# Altium schematic sheet Power.SchDoc
size A4; SheetNumber: 2; SheetTotal: 3
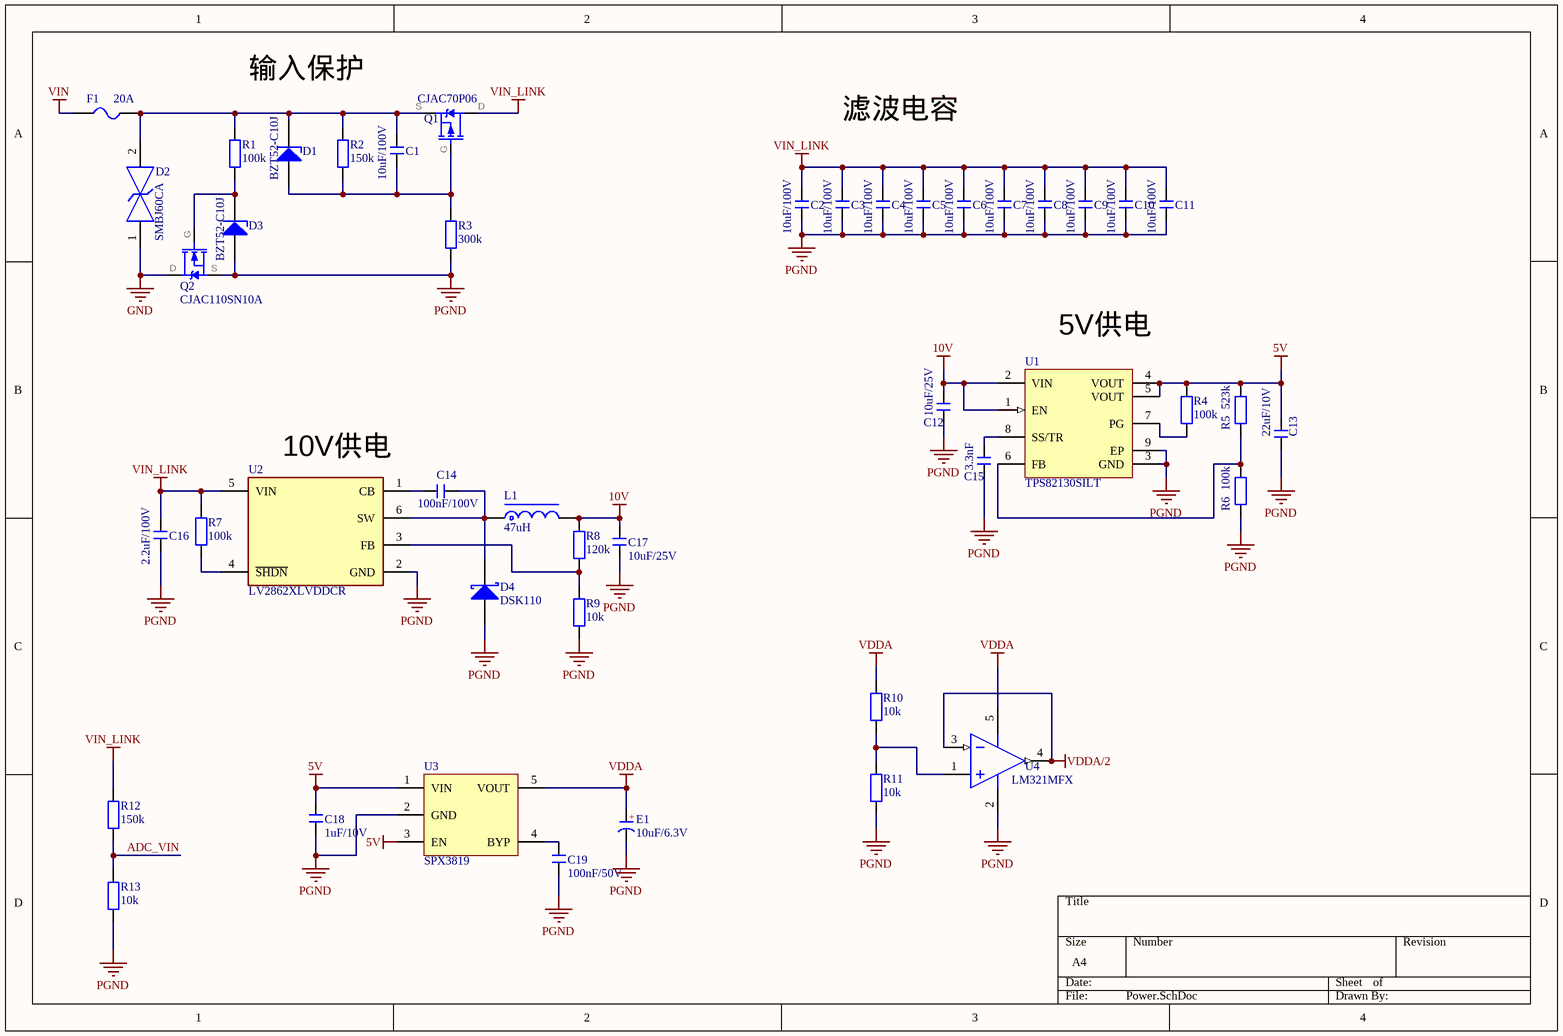
[diagram p0: Power.SchDoc]

## Parts
C1  10uF/100V  [Capacitor_1206_SMD]
C2  10uF/100V  [Capacitor_1206_SMD]
C3  10uF/100V  [Capacitor_1206_SMD]
C4  10uF/100V  [Capacitor_1206_SMD]
C5  10uF/100V  [Capacitor_1206_SMD]
C6  10uF/100V  [Capacitor_1206_SMD]
C7  10uF/100V  [Capacitor_1206_SMD]
C8  10uF/100V  [Capacitor_1206_SMD]
C9  10uF/100V  [Capacitor_1206_SMD]
C10  10uF/100V  [Capacitor_1206_SMD]
C11  10uF/100V  [Capacitor_1206_SMD]
C12  10uF/25V  [Capacitor_0603_SMD]
C13  22uF/10V  [Capacitor_0603_SMD]
C14  100nF/100V  [Capacitor_0603_SMD]
C15  3.3nF  [Capacitor_0402_SMD]
C16  2.2uF/100V  [Capacitor_1206_SMD]
C17  10uF/25V  [Capacitor_0603_SMD]
C18  1uF/10V  [Capacitor_0402_SMD]
C19  100nF/50V  [Capacitor_0402_SMD]
D1  BZT52-C10J  [SOD-123FL]
D2  SMBJ60CA  [FP-SMBJ-CA-MFG]
D3  BZT52-C10J  [SOD-123FL]
D4  DSK110  [SOD-123FL]
E1  10uF/6.3V  [Tantalum_Capacitor_0805_SMD]
F1  20A  [FU 1808]
L1  47uH  [Molded_Inductor_0530]
Q1  CJAC70P06  [PDFNWB5×6-8L]
Q2  CJAC110SN10A  [PDFNWB5×6-8L]
R1  100k  [Resistor_0402_SMD]
R2  150k  [Resistor_0402_SMD]
R3  300k  [Resistor_0402_SMD]
R4  100k  [Resistor_0402_SMD]
R5  523k  [Resistor_0402_SMD]
R6  100k  [Resistor_0402_SMD]
R7  100k  [Resistor_0402_SMD]
R8  120k  [Resistor_0402_SMD]
R9  10k  [Resistor_0402_SMD]
R10  10k  [Resistor_0402_SMD]
R11  10k  [Resistor_0402_SMD]
R12  150k  [Resistor_0402_SMD]
R13  10k  [Resistor_0402_SMD]
U1  TPS82130SILT  [SIL0008D_V]
U2  LV2862XLVDDCR  [FP-DDC0006A-MFG]
U3  SPX3819  [SOT23-5L]
U4  LM321MFX  [DBV0005A_L]

## Nets
5V: C13.2 C18.2 R4.2 R5.2 U1.4(VOUT) U1.5(VOUT) U3.1(VIN) U3.3(EN)
10V: C12.1 C17.1 L1.2 R8.2 U1.1(EN) U1.2(VIN)
GND: D2.1 Q2.D
PGND: C2.1 C3.1 C4.1 C5.1 C6.1 C7.1 C8.1 C9.1 C10.1 C11.1 C12.2 C13.1 C15.1 C16.2 C17.2 C18.1 C19.1 D3.1(A) D4.1(A) E1.2(K) Q2.S R3.1 R6.1 R9.2 R11.2 R13.1 U1.3(GND) U1.9(EP) U2.2(GND) U3.2(GND) U4.2(V-)
VDDA: E1.1(A) R10.1 U3.5(VOUT) U4.5(V+)
VDDA/2: U4.3(IN-) U4.4(OUT)
VIN: F1.1
VIN_LINK: C2.2 C3.2 C4.2 C5.2 C6.2 C7.2 C8.2 C9.2 C10.2 C11.2 C16.1 Q1.D R7.2 R12.2 U2.5(VIN)
ADC_VIN: R12.1 R13.2
NetC1_1: C1.1 D1.1(A) Q1.G R2.1 R3.2
NetC1_2: C1.2 D1.2(K) D2.2 F1.2 Q1.S R1.2 R2.2
NetC14_1: C14.1 U2.1(CB)
NetC14_2: C14.2 D4.2(K) L1.1 U2.6(SW)
NetC15_2: C15.2 U1.8(SS/TR)
NetC19_2: C19.2 U3.4(BYP)
NetD3_2: D3.2(K) Q2.G R1.1
NetR4_1: R4.1 U1.7(PG)
NetR5_1: R5.1 R6.2 U1.6(FB)
NetR7_1: R7.1 U2.4(~{SHDN})
NetR8_1: R8.1 R9.1 U2.3(FB)
NetR10_2: R10.2 R11.1 U4.1(IN+)

## Notes on the sheet
- 输入保护
- 滤波电容
- (near U1) 5V供电
- (near U2) 10V供电
- (in symbol C-CD) +

## Library data of the parts
C1-C19 = C: 无极性贴片电容; 版权归属: 源创客; BOM名称: 无极性贴片电容; 学习资源: www.ooocke.com
D1 D3 = 稳压二极管: Zener Diode; 联系卖家，免费查找封装: 唯一出售店铺网址https://shop463601444.taobao.com
D2 = CMP-08607-000060-1: TVS DIODE 60V DO214AA; Manufacturer Part Number: SMBJ48CA; Manufacturer: Littelfuse Inc; Number Of Channels: 1; Peak Pulse Current: 7.8A; Max Junction Temp: +150°C; Clamping Voltage: 77.4V; Breakdown Voltage: 53.3V; Direction: Bidirectional; Peak Pulse Power: 600W; Reverse Standoff Voltage: 48V; Temperature: -65°C to +150°C; ComponentLink2Description: Datasheet; Height: 2.61mm; ComponentLink2URL: https://www.littelfuse.com/~/media/electronics/datasheets/tvs_diodes/littelfuse_tvs_diode_smbj_datasheet.pdf.pdf; Temperature Range Low: -65°C; Automotive: No; RoHS: TRUE; Device Class L3: unset; Mouser Description: In a Pack of 25, Littelfuse SMBJ48CA, Bi-Directional TVS Diode, 600W, 2-Pin DO-214AA; Temperature Range High: +150°C; Octopart: https://octopart.com/smbj48ca-littelfuse-350748; Lead Free: Yes; Device Class L2: TVS Diodes; Digikey Description: TVS DIODE 48V 77.4V DO214AA; Device Class L1: Circuit Protection; Category: Diode; Package: SMBJ-CA
D4 = SS14: 肖特基二极管; 属性: 40V/1A; 联系卖家，免费查找封装: 唯一出售店铺网址https://shop463601444.taobao.com; BOM名称: 肖特基二极管
E1 = C-CD: 贴片钽电容; 版权归属: 源创客; BOM名称: 贴片钽电容; 学习资源: www.ooocke.com
F1 = FU: 贴片保险丝; 版权归属: 源创客; BOM名称: 贴片保险丝; 学习资源: www.ooocke.com
L1 = L-CD: 贴片功率电感; BOM名称: 功率电感; 版权归属: 源创客; 学习资源: www.ooocke.com
Q1 = CJAC70P06: -70A 7.6mΩ@-10V P-Channel Power MOSFET
Q2 = CJAC110SN10A: 110A 3.4mΩ@10V N-Channel Power MOSFET
R1-R4 R6-R13 = R: 贴片电阻; 版权归属: 源创客; BOM名称: 贴片电阻; 学习资源: www.ooocke.com
R5 = R: 贴片电阻
U1 = CMP-2000-07569-1: Step-Down Converter MicroSiP(TM) Module with Integrated Inductor, 3 A, 3 to 17 V, -40 to 125 degC, 8-Pin uSiP (SIL), Tape and Reel; Manufacturer: Texas Instruments; Quiescent Current: 20uA; Output Voltage: 5V; Output Current: 3A; Max Input Voltage: 17V; Switching Frequency: 2MHz; Min Output Voltage: 900mV; Number of Outputs: 1; Min Input Voltage: 3V; Datasheet URL: http://www.ti.com/lit/ds/symlink/tps82130.pdf; Packaging: CutTape; Datasheet Version: Rev. C, 01/2017; Package Reference: SIL0008D; Case/Package: SMD/SMT; Manufacturer URL: http://www.ti.com/; Length: 0.12inch; Lead Free: LeadFree; Mount: SurfaceMount; Number of Pins: 8; Package Description: 8-Pin Single In-line Package, Body 3 x 2.8 mm, Pitch 0.65 mm; Max Output Voltage: 5V; Mounting Technology: SurfaceMount; Height: 0.06inch; Max Operating Temperature: 125degC; Width: 0.11inch; Min Operating Temperature: -40degC; Voltage - Output 1: 5V; RoHSCompliant: True; REACH SVHC: NoSVHC; Max Output Current: 3A
U2 = CMP-04918-000583-1: Switching Voltage Regulators 4.5-V to 60-V, 600-mA buck converter in ultra-small SOT23 package 6-SOT-23-THIN -40 to 125
U3 = SPX3819: 500mA Low-Noise LDO Voltage Regulator
U4 = CMP-0055-01337-3: Low Power Single Op Amp, 5-pin SOT-23; Manufacturer: Texas Instruments; PowerWise: N; CompType: Amplifiers; PackageTopMarking: A63A*XTT; ComponentLink1Description: Datasheet URL; PackageDescription: Molded SOT-23, .115 x .063 x .040 in Body, 5 Lead, .0375 in Pitch; PinCount: 5; ComponentLink1URL: http://www.ti.com/general/docs/lit/getliterature.tsp?genericPartNumber=LM321&fileType=pdf; RoHS: N; Package Reference: DBV0005A